# EAGLE design jevois_pi (EAGLE 8.4.1)
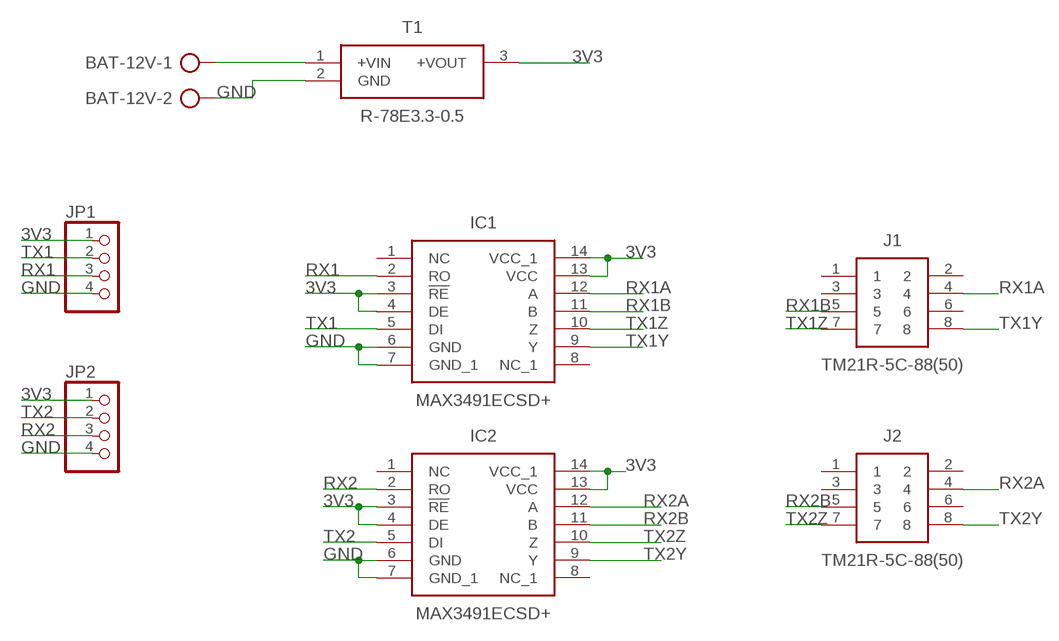
[diagram p0: schematic, sheet 1]

## Parts
BAT-12V  AK500/2-H  [AK500/2-H]
IC1  MAX3491ECSD+  [SOIC127P600X175-14N]
IC2  MAX3491ECSD+  [SOIC127P600X175-14N]
J1  TM21R-5C-88(50)  [TM21R-5C-88(50)]
J2  TM21R-5C-88(50)  [TM21R-5C-88(50)]
JP1  PINHD-1X4  [1X04]
JP2  PINHD-1X4  [1X04]
T1  R-78E3.3-0.5  [SHDRV3W100P0_254_1X3_1160X850X]

## Nets
3V3: IC1.3(!RE) IC1.4(DE) IC1.13(VCC) IC1.14(VCC_1) IC2.3(!RE) IC2.4(DE) IC2.13(VCC) IC2.14(VCC_1) JP1.1 JP2.1 T1.3(+VOUT)
GND: BAT-12V.2 IC1.6(GND) IC1.7(GND_1) IC2.6(GND) IC2.7(GND_1) JP1.4 JP2.4 T1.2(GND)
N$3: BAT-12V.1 T1.1(+VIN)
RX1: IC1.2(RO) JP1.3
RX1A: IC1.12(A) J1.4
RX1B: IC1.11(B) J1.5
RX2: IC2.2(RO) JP2.3
RX2A: IC2.12(A) J2.4
RX2B: IC2.11(B) J2.5
TX1: IC1.5(DI) JP1.2
TX1Y: IC1.9(Y) J1.8
TX1Z: IC1.10(Z) J1.7
TX2: IC2.5(DI) JP2.2
TX2Y: IC2.9(Y) J2.8
TX2Z: IC2.10(Z) J2.7
Unconnected: IC1.1(NC) IC1.8(NC_1) IC2.1(NC) IC2.8(NC_1) J1.1 J1.2 J1.3 J1.6 J2.1 J2.2 J2.3 J2.6

## Library data of the parts
BAT-12V = con-ptr500:AK500/2-H: CONNECTOR Aug. 2004 / PTR Meßtechnik: Die Bezeichnung der Serie AK505 wurde geändert. Es handelt sich hierbei um AK500 in horizontaler Ausführung.; OC_FARNELL: unknown; OC_NEWARK: unknown
IC1 IC2 = enac_jevois:MAX3491ECSD+: MAX3491ECSD+, Line Transceiver, RS-485, RS-422 15 Mbit/s Differential, 3.3 V, 14-Pin SOIC <https://componentsearchengine.com/Images/1/MAX3491ECSD%2B.jpg> Source: Datasheet <http://docs-europe.electrocomponents.com/webdocs/0f63/0900766b80f63332.pdf>; DESCRIPTION: MAX3491ECSD+, Line Transceiver, RS-485, RS-422 15 Mbit/s Differential, 3.3 V, 14-Pin SOIC; HEIGHT: 1.75mm; MANUFACTURER_NAME: Maxim Integrated; MANUFACTURER_PART_NUMBER: MAX3491ECSD+; RS_PART_NUMBER: 7329496; SUPPLIER_NAME: RS
J1 J2 = enac_jevois:TM21R-5C-88(50): 8 way Cat6 shielded RJ45 PCB socket,1.5A Hirose Cat5e RJ45 Connector Socket, STP, Right Angle, Through Hole <https://componentsearchengine.com/Images/3/TM21R-5C-88%2850%29.jpg> Source: Datasheet <https://www.hirose.com/product/en/download_file/key_name/TM21R-5C-88-LP(50)/category/Drawing (2D)/doc_file_id/79045/?file_category_id=6&item_id=02222892050&is_series=>; DESCRIPTION: 8 way Cat6 shielded RJ45 PCB socket,1.5A Hirose Cat5e RJ45 Connector Socket, STP, Right Angle, Through Hole; HEIGHT: mm; MANUFACTURER_NAME: Hirose; MANUFACTURER_PART_NUMBER: TM21R-5C-88(50); RS_PART_NUMBER: 6256710; SUPPLIER_NAME: RS
JP1 JP2 = pinhead:PINHD-1X4: PIN HEADER
T1 = enac_jevois:R-78E3.3-0.5: Switching Regulator 6-28Vin 3.3Vout 0.5A Switching Regulator, 6 <https://componentsearchengine.com/Images/3/R-78E3.3-0.5.jpg> Source: Datasheet <http://www.recom-power.com/pdf/Innoline/R-78Exx-0.5.pdf>; DESCRIPTION: Switching Regulator 6-28Vin 3.3Vout 0.5A Switching Regulator, 6; HEIGHT: mm; MANUFACTURER_NAME: RECOM Power; MANUFACTURER_PART_NUMBER: R-78E3.3-0.5; RS_PART_NUMBER: 7773291; SUPPLIER_NAME: RS

## Board
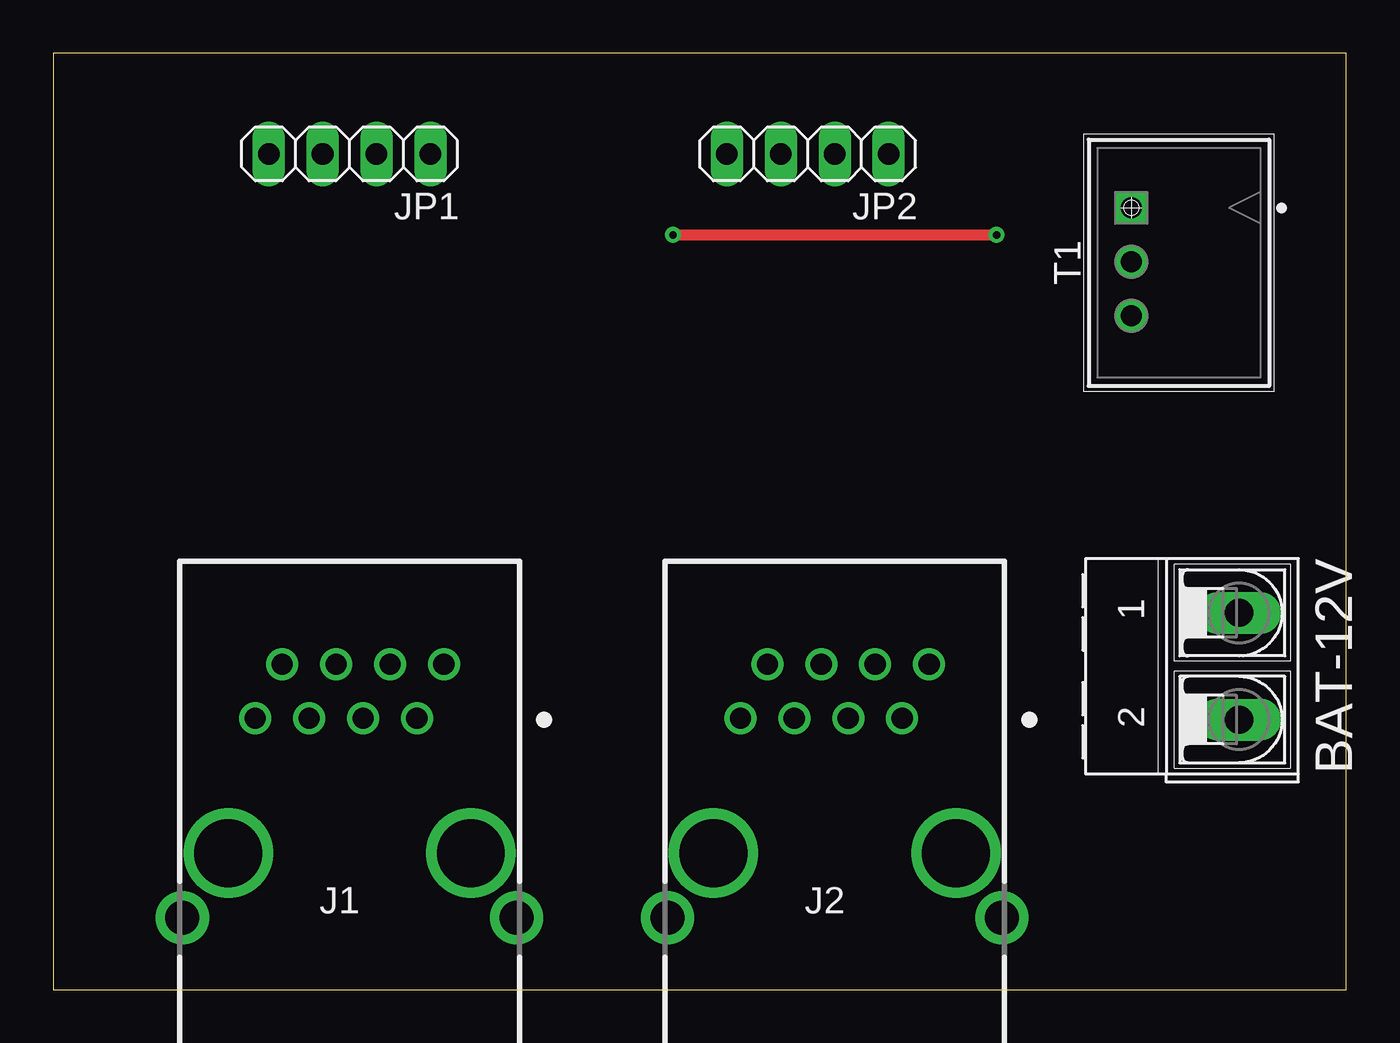
[diagram p1: board, top side]
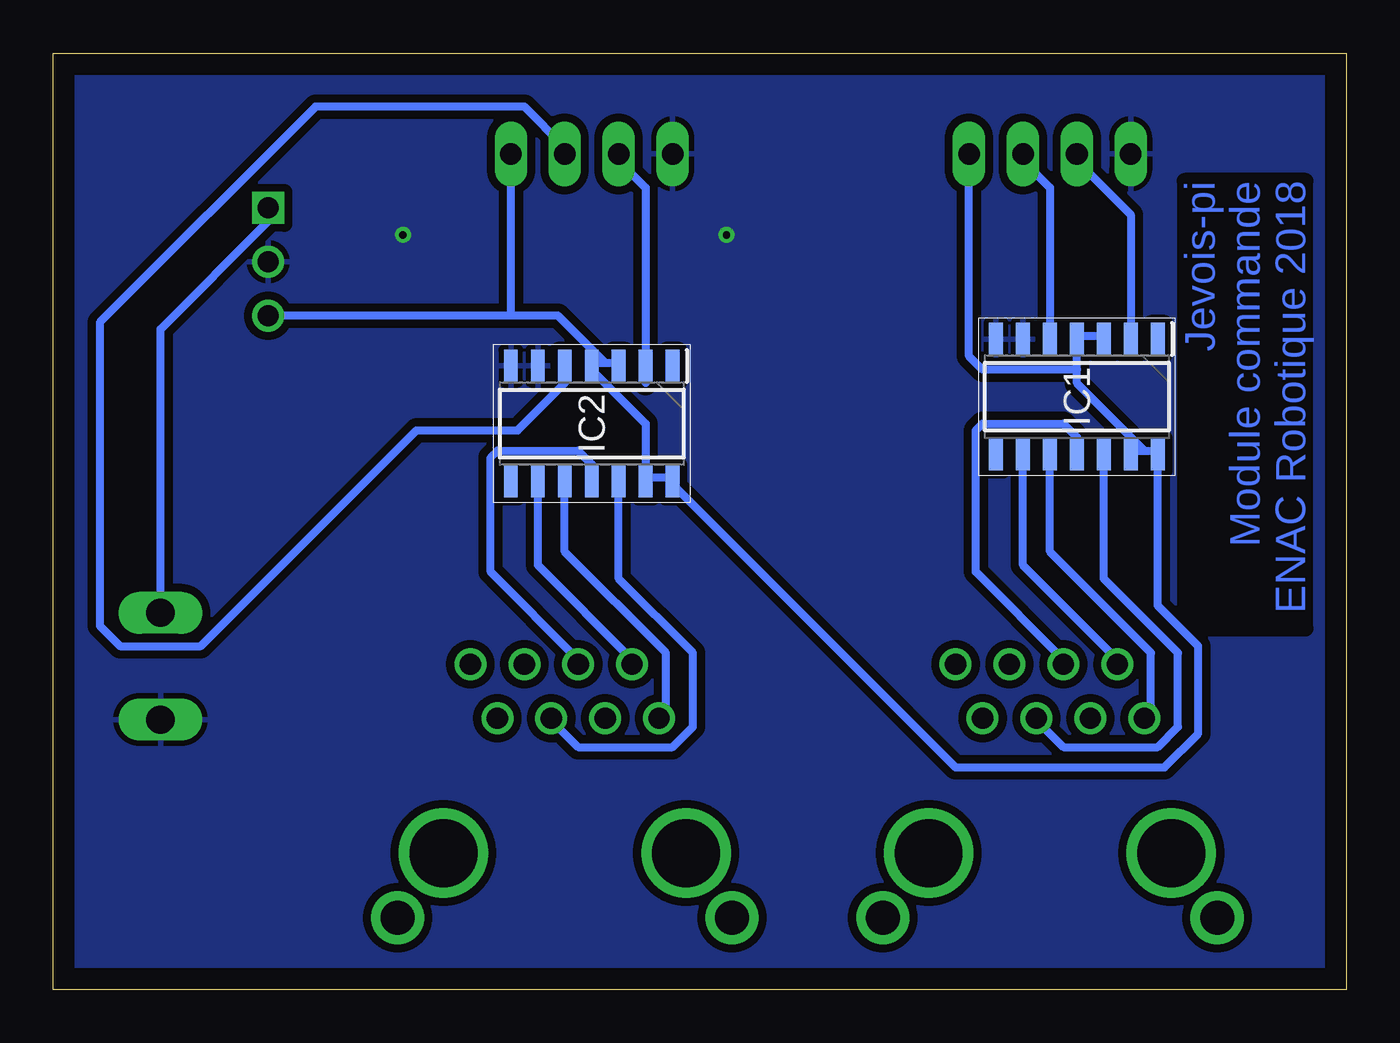
[diagram p2: board, bottom side, seen from below]

Size 60.94 x 44.12 mm. Coordinates in mm from the lower left corner, seen from the top.
Outline: 0,0 60.94,0 60.94,44.12 0,44.12 0,0
Copper layers (1*16): Top 0.035mm / dielectric 1.5mm / Bottom 0.035mm
Design rules "base": minimum track width 15mil, minimum drill 0.35mm, track to track 15mil, track to pad 15mil, pad to pad 15mil, via to via 6mil, smd to smd 6mil, copper to edge 40mil, drill to drill 6mil, minimum pad ring 10mil, minimum via ring 8mil, stop-mask expansion 4mil, vias tented up to drill 0mil, thermal gap 10mil

### Footprints (pad centres in the part's own frame; a part is rotated, then mirrored left to right if it is on the bottom)
AK500/2-H = drill 1.321 long: 1 -2.515,0; 2 2.515,0
SOIC127P600X175-14N = smd 1.525 x 0.65: 1 -2.712,3.81; 2 -2.712,2.54; 3 -2.712,1.27; 4 -2.712,0; 5 -2.712,-1.27; 6 -2.712,-2.54; 7 -2.712,-3.81; 8 2.712,-3.81; 9 2.712,-2.54; 10 2.712,-1.27; 11 2.712,0; 12 2.712,1.27; 13 2.712,2.54; 14 2.712,3.81
TM21R-5C-88(50) = drill 1 pad 1.5: 1 3.175,16.6; 2 4.445,19.14; 3 1.905,19.14; 4 0.635,16.6; 5 -0.635,19.14; 6 -1.905,16.6; 7 -4.445,16.6; 8 -3.175,19.14 | drill 3.2 pad 3.2: 9 -5.715,10.25; 10 5.715,10.25 | drill 1.6 pad 2.5: 11 -7.875,7.2; 12 7.875,7.2
1X04 = drill 1.016 long: 1 -3.81,0; 2 -1.27,0; 3 1.27,0; 4 3.81,0
SHDRV3W100P0_254_1X3_1160X850X = drill 1 pad 1.5 square: 1 0,0 | drill 1 pad 1.5: 2 2.54,0; 3 5.08,0

### Placement (x,y rotation side)
BAT-12V  55.88,15.24 270 top
IC1  12.7,27.94 270 bottom
IC2  35.56,26.67 270 bottom
J1  13.97,-3.81 0 top
J2  36.83,-3.81 0 top
JP1  13.97,39.37 180 top
JP2  35.56,39.37 180 top
T1  50.8,36.83 270 top

### Tracks (layer width: path | path; a pad name or v marks a point on that pad's centre or on a via)
3V3
  Bottom 0.381: 9.53,25.4 10.16,25.4 IC1.13 | 9.53,25.4 8.89,25.4 IC1.14 8.89,18.1 6.99,16.19 6.99,12.06 8.57,10.48 18.41,10.48 31.75,23.81 IC2.14 31.75,24.13 33.02,24.13 | 34.92,29.53 35.56,29.53 IC2.4 35.56,29.21 33.02,26.67 33.02,24.13 | 34.92,29.53 34.29,29.53 IC2.3 | 33.02,24.13 IC2.13 | 39.37,31.75 37.15,31.75 34.92,29.53 | 39.37,31.75 T1.3 | 12.7,29.21 IC1.4 12.7,30.8 11.43,30.8 IC1.3 | 12.7,29.21 12.7,28.57 9.53,25.4 | JP1.1 17.78,29.84 17.14,29.21 12.7,29.21 | 39.37,31.75 JP2.1
GND  (via drill 0.35)
  Top 0.508: v29.21,35.56 v44.45,35.56
  pour Bottom: 0,0 0,44.45 60.96,44.45 60.96,0
N$3
  Bottom 0.381: T1.1 50.8,36.2 55.88,31.11 BAT-12V.1
RX1
  Bottom 0.381: IC1.2 10.16,36.51 12.7,39.05 JP1.3
RX1A
  Bottom 0.381: IC1.12 11.43,19.37 7.94,15.88 7.94,12.38 8.89,11.43 13.34,11.43 14.61,12.7 J1.4
RX1B
  Bottom 0.381: IC1.11 12.7,26.04 13.34,26.67 17.14,26.67 17.46,26.35 17.46,19.68 13.34,15.56 J1.5
RX2
  Bottom 0.381: 33.02,28.57 IC2.2 33.02,37.78 34.29,39.05 JP2.3
RX2A
  Bottom 0.381: IC2.12 34.29,19.37 30.8,15.88 30.8,12.38 31.75,11.43 36.2,11.43 37.47,12.7 J2.4
RX2B
  Bottom 0.381: IC2.11 35.56,24.77 36.2,25.4 40.01,25.4 40.32,25.08 40.32,19.68 36.2,15.56 J2.5
TX1
  Bottom 0.381: IC1.5 13.97,37.78 15.24,39.05 JP1.2
TX1Y
  Bottom 0.381: IC1.9 15.24,20 10.79,15.56 J1.8
TX1Z
  Bottom 0.381: IC1.10 13.97,20.64 9.21,15.88 9.21,13.34 9.53,13.02 J1.7
TX2
  Bottom 0.381: IC2.5 36.83,28.57 39.05,26.35 43.81,26.35 53.98,16.19 57.78,16.19 58.74,17.14 58.74,31.43 48.58,41.59 38.73,41.59 36.83,39.69 JP2.2
TX2Y
  Bottom 0.381: IC2.9 38.1,20 33.66,15.56 J2.8
TX2Z
  Bottom 0.381: IC2.10 36.83,20.64 32.07,15.88 32.07,13.34 32.38,13.02 J2.7

### Text on the board
Bottom: Jevois-pi / Module commande / ENAC Robotique 2018